# Altium schematic sheet ECU_Sheet4.SchDoc
size A3
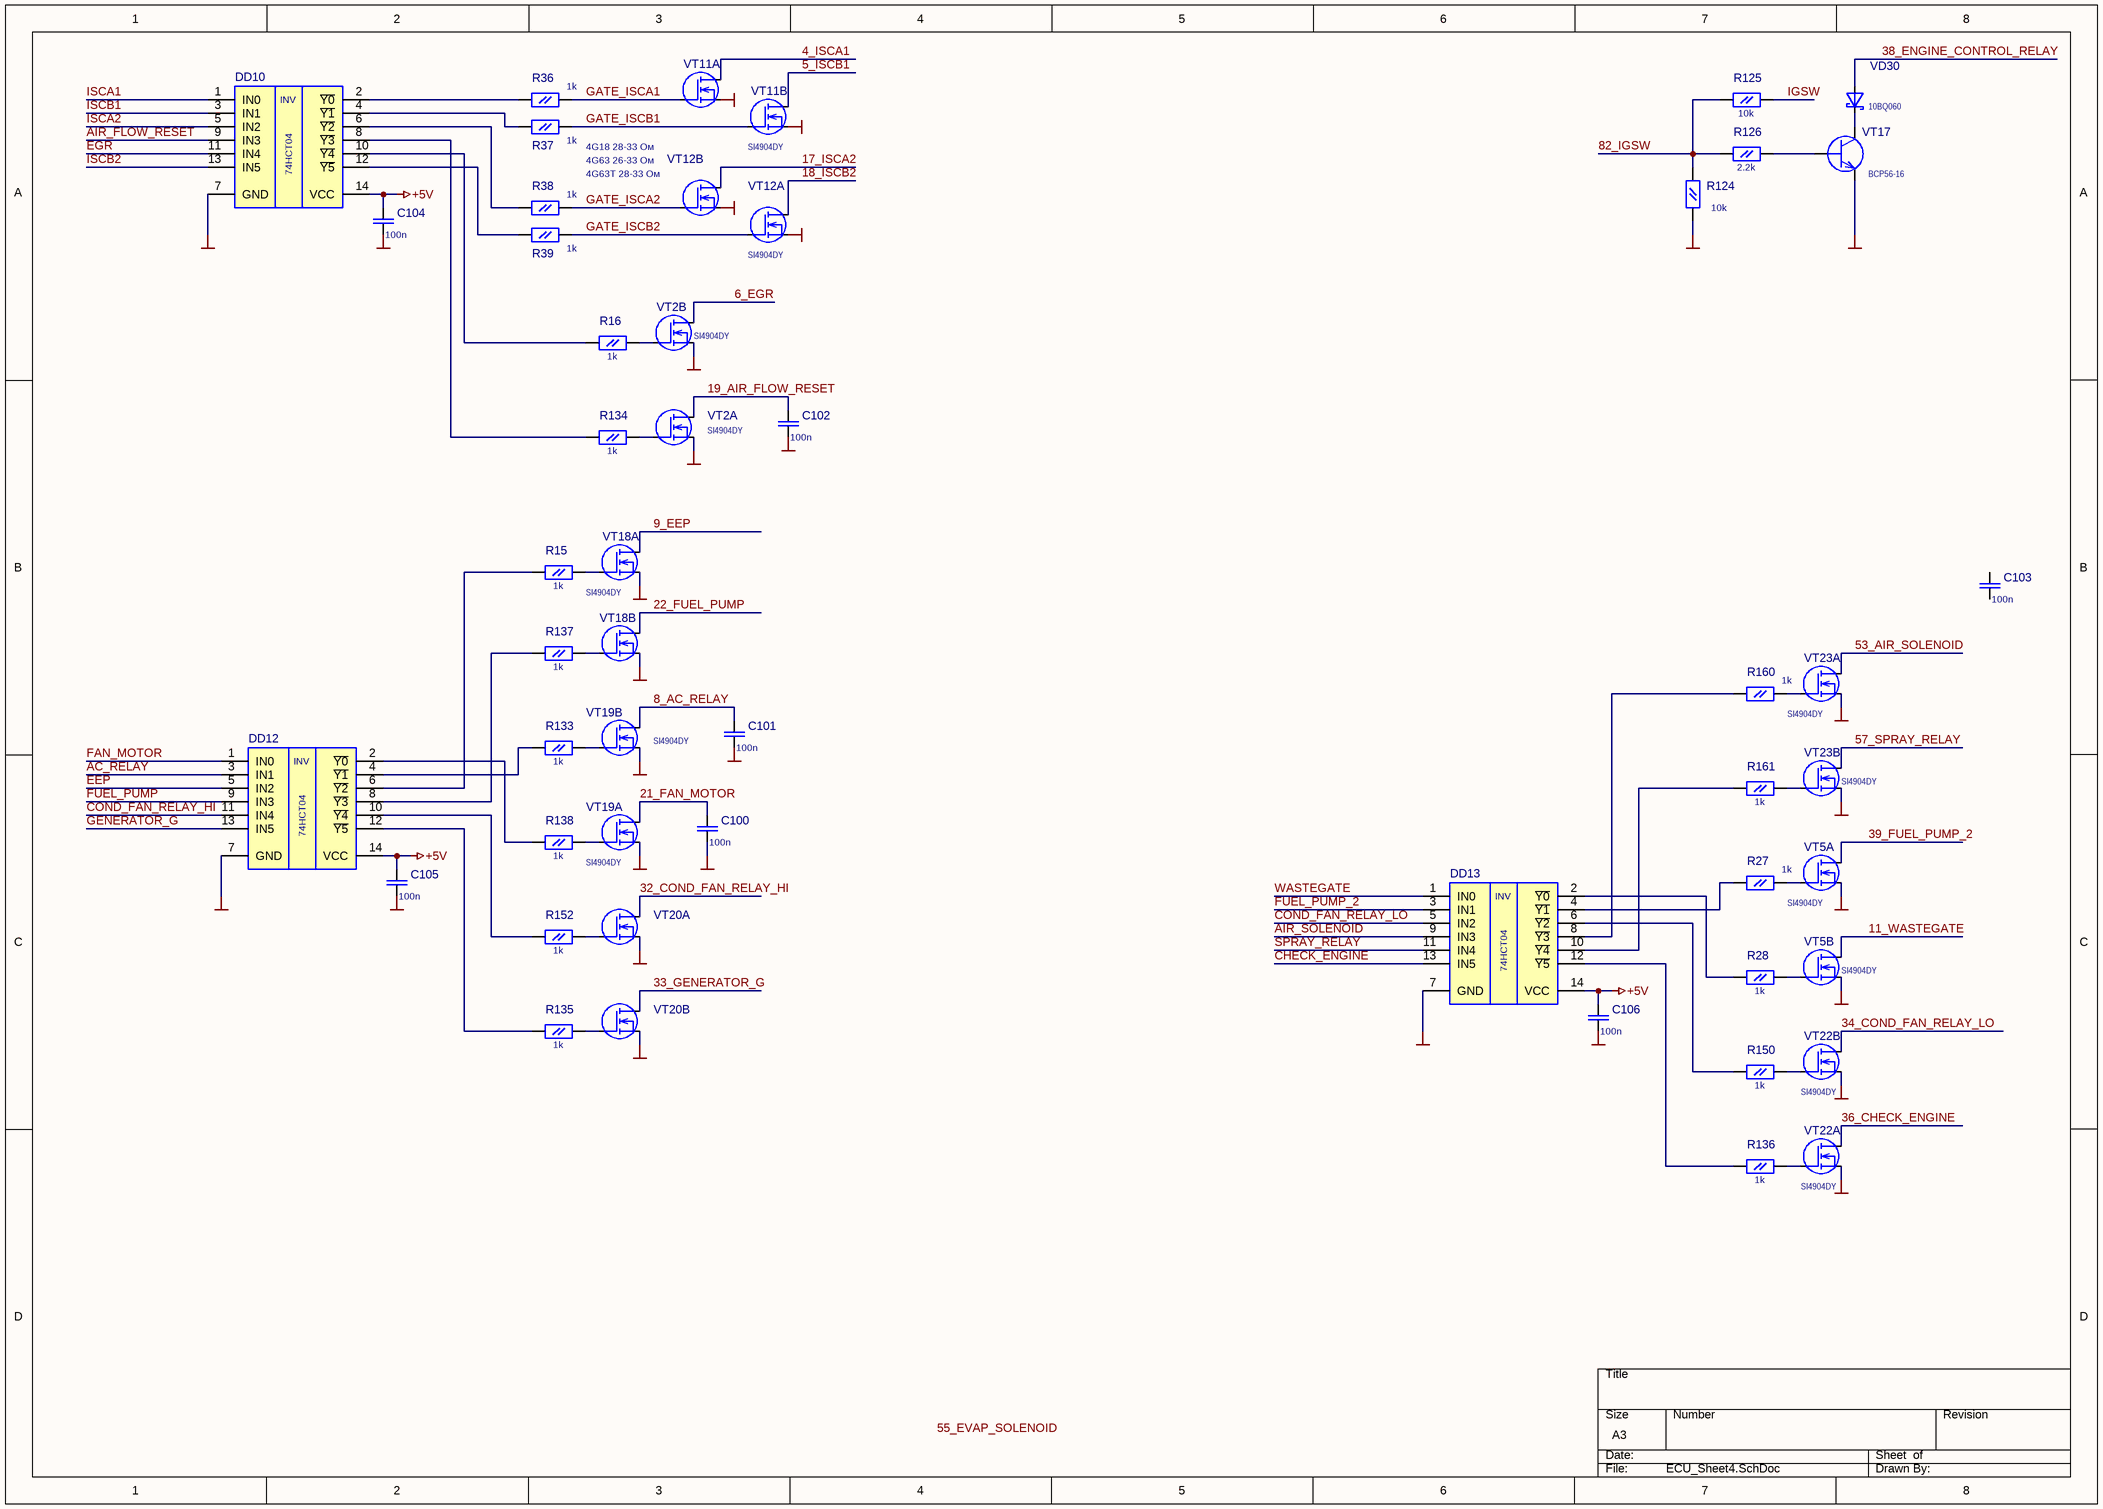
[diagram p0: ECU_Sheet4.SchDoc]

## Parts
C100  value 100n  [C0805L]  (hidden comment: CSMD)
C101  value 100n  [C0805L]  (hidden comment: CSMD)
C102  value 100n  [C0805L]  (hidden comment: CSMD)
C103  value 100n  [C0805L]  (hidden comment: CSMD)
C104  value 100n  [C0805L]  (hidden comment: 0.1мкФ-25В-X8R-10%)
C105  value 100n  [C0805L]  (hidden comment: 0.1мкФ-25В-X8R-10%)
C106  value 100n  [C0805L]  (hidden comment: 0.1мкФ-25В-X8R-10%)
DD10  74HCT04  [TSSOP14 (JEDEC MO-153)]
DD12  74HCT04  [TSSOP14 (JEDEC MO-153)]
DD13  74HCT04  [TSSOP14 (JEDEC MO-153)]
R15  value 1k  [R0805L]  (hidden comment: RSMD)
R16  value 1k  [R0805L]  (hidden comment: RSMD)
R27  value 1k  [R0805L]  (hidden comment: RSMD)
R28  value 1k  [R0805L]  (hidden comment: RSMD)
R36  value 1k  [R0805L]  (hidden comment: RSMD)
R37  value 1k  [R0805L]  (hidden comment: RSMD)
R38  value 1k  [R0805L]  (hidden comment: RSMD)
R39  value 1k  [R0805L]  (hidden comment: RSMD)
R124  value 10k  [R0805L]  (hidden comment: RSMD)
R125  value 10k  [R0805L]  (hidden comment: RSMD)
R126  value 2.2k  [R0805L]  (hidden comment: RSMD)
R133  value 1k  [R0805L]  (hidden comment: RSMD)
R134  value 1k  [R0805L]  (hidden comment: RSMD)
R135  value 1k  [R0805L]  (hidden comment: RSMD)
R136  value 1k  [R0805L]  (hidden comment: RSMD)
R137  value 1k  [R0805L]  (hidden comment: RSMD)
R138  value 1k  [R0805L]  (hidden comment: RSMD)
R150  value 1k  [R0805L]  (hidden comment: RSMD)
R152  value 1k  [R0805L]  (hidden comment: RSMD)
R160  value 1k  [R0805L]  (hidden comment: RSMD)
R161  value 1k  [R0805L]  (hidden comment: RSMD)
VD30  10BQ060  [DO-214AA SMB]
VT2  SI4904DY  [SOIC8 DBL FET]  (parts A,B of 2)
VT5  SI4904DY  [SOIC8 DBL FET]  (parts A,B of 2)
VT11  SI4904DY  [SOIC8 DBL FET]  (value not drawn)  (parts A,B of 2)
VT12  SI4904DY  [SOIC8 DBL FET]  (parts A,B of 2)
VT17  BCP56-16  [SOT-223 PWR]
VT18  SI4904DY  [SOIC8 DBL FET]  (parts A,B of 2)
VT19  SI4904DY  [SOIC8 DBL FET]  (parts A,B of 2)
VT20  SI4904DY  [SOIC8 DBL FET]  (value not drawn)  (parts A,B of 2)
VT22  SI4904DY  [SOIC8 DBL FET]  (parts A,B of 2)
VT23  SI4904DY  [SOIC8 DBL FET]  (parts A,B of 2)

## Nets
+5V: C104.1 C105.1 C106.1 DD10.14(VCC) DD12.14(VCC) DD13.14(VCC)
GND: C100.2 C101.2 C102.2 C104.2 C105.2 C106.2 DD10.7(GND) DD12.7(GND) DD13.7(GND) R124.1(Pin1) VT2.1 VT2.3 VT5.1 VT5.3 VT11.1 VT11.3 VT12.1 VT12.3 VT17.3(E) VT18.1 VT18.3 VT19.1 VT19.3 VT20.1 VT20.3 VT22.1 VT22.3 VT23.1 VT23.3
4_ISCA1: VT11.6
5_ISCB1: VT11.5
6_EGR: VT2.5
8_AC_RELAY: C101.1 VT19.5
9_EEP: VT18.6
11_WASTEGATE: VT5.5
17_ISCA2: VT12.5
18_ISCB2: VT12.6
19_AIR_FLOW_RESET: C102.1 VT2.6
21_FAN_MOTOR: C100.1 VT19.6
22_FUEL_PUMP: VT18.5
32_COND_FAN_RELAY_HI: VT20.6
33_GENERATOR_G: VT20.5
34_COND_FAN_RELAY_LO: VT22.5
36_CHECK_ENGINE: VT22.6
38_ENGINE_CONTROL_RELAY: VD30.1
39_FUEL_PUMP_2: VT5.6
53_AIR_SOLENOID: VT23.6
57_SPRAY_RELAY: VT23.5
82_IGSW: R124.2(Pin2) R125.1(Pin1) R126.1(Pin1)
AC_RELAY: DD12.3(IN1)
AIR_FLOW_RESET: DD10.9(IN3)
AIR_SOLENOID: DD13.9(IN3)
CHECK_ENGINE: DD13.13(IN5)
COND_FAN_RELAY_HI: DD12.11(IN4)
COND_FAN_RELAY_LO: DD13.5(IN2)
EEP: DD12.5(IN2)
EGR: DD10.11(IN4)
FAN_MOTOR: DD12.1(IN0)
FUEL_PUMP: DD12.9(IN3)
FUEL_PUMP_2: DD13.3(IN1)
GATE_ISCA1: R36.2(Pin2) VT11.2
GATE_ISCA2: R38.2(Pin2) VT12.4
GATE_ISCB1: R37.2(Pin2) VT11.4
GATE_ISCB2: R39.2(Pin2) VT12.2
GENERATOR_G: DD12.13(IN5)
IGSW: R125.2(Pin2)
ISCA1: DD10.1(IN0)
ISCA2: DD10.5(IN2)
ISCB1: DD10.3(IN1)
ISCB2: DD10.13(IN5)
SPRAY_RELAY: DD13.11(IN4)
WASTEGATE: DD13.1(IN0)
NetDD10_2: DD10.2(~{Y0}) R36.1(Pin1)
NetDD10_4: DD10.4(~{Y1}) R37.1(Pin1)
NetDD10_6: DD10.6(~{Y2}) R38.1(Pin1)
NetDD10_8: DD10.8(~{Y3}) R134.1(Pin1)
NetDD10_10: DD10.10(~{Y4}) R16.1(Pin1)
NetDD10_12: DD10.12(~{Y5}) R39.1(Pin1)
NetDD12_2: DD12.2(~{Y0}) R138.1(Pin1)
NetDD12_4: DD12.4(~{Y1}) R133.1(Pin1)
NetDD12_6: DD12.6(~{Y2}) R15.1(Pin1)
NetDD12_8: DD12.8(~{Y3}) R137.1(Pin1)
NetDD12_10: DD12.10(~{Y4}) R152.1(Pin1)
NetDD12_12: DD12.12(~{Y5}) R135.1(Pin1)
NetDD13_2: DD13.2(~{Y0}) R28.1(Pin1)
NetDD13_4: DD13.4(~{Y1}) R27.1(Pin1)
NetDD13_6: DD13.6(~{Y2}) R150.1(Pin1)
NetDD13_8: DD13.8(~{Y3}) R160.1(Pin1)
NetDD13_10: DD13.10(~{Y4}) R161.1(Pin1)
NetDD13_12: DD13.12(~{Y5}) R136.1(Pin1)
NetR15_2: R15.2(Pin2) VT18.2
NetR16_2: R16.2(Pin2) VT2.4
NetR27_2: R27.2(Pin2) VT5.2
NetR28_2: R28.2(Pin2) VT5.4
NetR126_2: R126.2(Pin2) VT17.1(B)
NetR133_2: R133.2(Pin2) VT19.4
NetR134_2: R134.2(Pin2) VT2.2
NetR135_2: R135.2(Pin2) VT20.4
NetR136_2: R136.2(Pin2) VT22.2
NetR137_2: R137.2(Pin2) VT18.4
NetR138_2: R138.2(Pin2) VT19.2
NetR150_2: R150.2(Pin2) VT22.4
NetR152_2: R152.2(Pin2) VT20.2
NetR160_2: R160.2(Pin2) VT23.2
NetR161_2: R161.2(Pin2) VT23.4
NetVD30_2: VD30.2 VT17.2(C)

Not connected (* = marked no-connect by the designer): C103 1 2

## Notes on the sheet
- 4G18 28-33 Ом
- 4G63 26-33 Ом
- 4G63T 28-33 Ом
- Labels drawn without touching a wire or pin: 55_EVAP_SOLENOID
- (in symbol 74HCT04) INV

## Library data of the parts
C100-C106 = CSMD: C0603; Voltage: *; Part Field 1: *; Part Field 2: *
R15 R16 R27 R28 R36-R39 R124-R126 R133-R138 R150 R152 R160 R161 = RSMD: R0805
  R15 R16 R27 R28 R36-R39 R137 R138 R160 R161: Part Field 1: *; Part Field 2: *
VT2 VT5 VT11 VT12 VT18-VT20 VT22 VT23 = SQ9945BEY: SI4904DY или IRF7341TRPBF или SI4908DY
DD10 DD12 DD13 = 74HCT04: Part Field 1: *; Part Field 2: *
VD30 = 10BQ060: Value: *
VT17 = BCP56-16: Value: *